# Altium schematic sheet SDRAM.SchDoc: SDRAM
size 420 x 297 mm; CompanyName: STMicroelectronics; Organization: Microcontrollers Division; DocumentNumber: 14; SheetNumber: 9; SheetTotal: 19
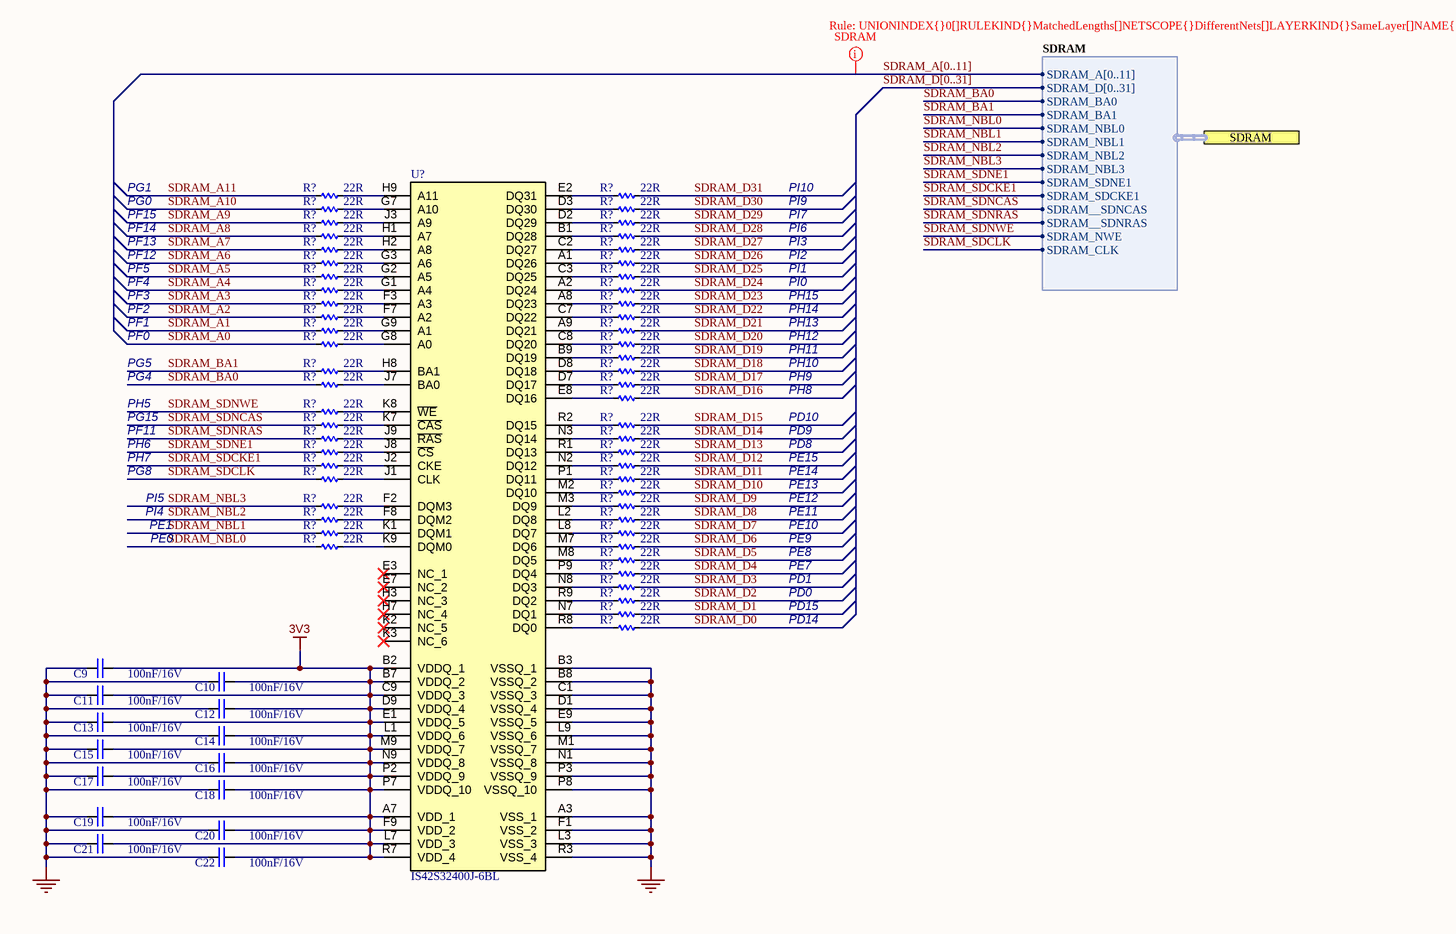
[diagram p0: SDRAM.SchDoc]

## Parts
(Parts that share a designator on the sheet are numbered #1, #2 ... from top to bottom, then left to right.)
C9  100nF/16V  [CAP_C_1608X80]
C10  100nF/16V  [CAP_C_1608X80]
C11  100nF/16V  [CAP_C_1608X80]
C12  100nF/16V  [CAP_C_1608X80]
C13  100nF/16V  [CAP_C_1608X80]
C14  100nF/16V  [CAP_C_1608X80]
C15  100nF/16V  [CAP_C_1608X80]
C16  100nF/16V  [CAP_C_1608X80]
C17  100nF/16V  [CAP_C_1608X80]
C18  100nF/16V  [CAP_C_1608X80]
C19  100nF/16V  [CAP_C_1608X80]
C20  100nF/16V  [CAP_C_1608X80]
C21  100nF/16V  [CAP_C_1608X80]
C22  100nF/16V  [CAP_C_1608X80]
R?#1  22R  [RES_C_1608X60]
R?#2  22R  [RES_C_1608X60]
R?#3  22R  [RES_C_1608X60]
R?#4  22R  [RES_C_1608X60]
R?#5  22R  [RES_C_1608X60]
R?#6  22R  [RES_C_1608X60]
R?#7  22R  [RES_C_1608X60]
R?#8  22R  [RES_C_1608X60]
R?#9  22R  [RES_C_1608X60]
R?#10  22R  [RES_C_1608X60]
R?#11  22R  [RES_C_1608X60]
R?#12  22R  [RES_C_1608X60]
R?#13  22R  [RES_C_1608X60]
R?#14  22R  [RES_C_1608X60]
R?#15  22R  [RES_C_1608X60]
R?#16  22R  [RES_C_1608X60]
R?#17  22R  [RES_C_1608X60]
R?#18  22R  [RES_C_1608X60]
R?#19  22R  [RES_C_1608X60]
R?#20  22R  [RES_C_1608X60]
R?#21  22R  [RES_C_1608X60]
R?#22  22R  [RES_C_1608X60]
R?#23  22R  [RES_C_1608X60]
R?#24  22R  [RES_C_1608X60]
R?#25  22R  [RES_C_1608X60]
R?#26  22R  [RES_C_1608X60]
R?#27  22R  [RES_C_1608X60]
R?#28  22R  [RES_C_1608X60]
R?#29  22R  [RES_C_1608X60]
R?#30  22R  [RES_C_1608X60]
R?#31  22R  [RES_C_1608X60]
R?#32  22R  [RES_C_1608X60]
R?#33  22R  [RES_C_1608X60]
R?#34  22R  [RES_C_1608X60]
R?#35  22R  [RES_C_1608X60]
R?#36  22R  [RES_C_1608X60]
R?#37  22R  [RES_C_1608X60]
R?#38  22R  [RES_C_1608X60]
R?#39  22R  [RES_C_1608X60]
R?#40  22R  [RES_C_1608X60]
R?#41  22R  [RES_C_1608X60]
R?#42  22R  [RES_C_1608X60]
R?#43  22R  [RES_C_1608X60]
R?#44  22R  [RES_C_1608X60]
R?#45  22R  [RES_C_1608X60]
R?#46  22R  [RES_C_1608X60]
R?#47  22R  [RES_C_1608X60]
R?#48  22R  [RES_C_1608X60]
R?#49  22R  [RES_C_1608X60]
R?#50  22R  [RES_C_1608X60]
R?#51  22R  [RES_C_1608X60]
R?#52  22R  [RES_C_1608X60]
R?#53  22R  [RES_C_1608X60]
R?#54  22R  [RES_C_1608X60]
R?#55  22R  [RES_C_1608X60]
R?#56  22R  [RES_C_1608X60]
U?  IS42S32400J-6BL  [BGA90C80P9X15_800X1300X120]

## Ports
SDRAM (harness SDRAM)

## Harnesses
SDRAM: SDRAM_A[0..11], SDRAM__SDNCAS, SDRAM_NBL0, SDRAM_SDNE1, SDRAM_SDCKE1, SDRAM_D[0..31], SDRAM_NBL1, SDRAM_BA0, SDRAM_BA1, SDRAM_NWE, SDRAM_CLK, SDRAM__SDNRAS, SDRAM_NBL3, SDRAM_NBL2

## Nets
3V3: C9.2 C10.2 C11.2 C12.2 C13.2 C14.2 C15.2 C16.2 C17.2 C18.2 C19.2 C20.2 C21.2 C22.2 U?.A7(VDD_1) U?.B2(VDDQ_1) U?.B7(VDDQ_2) U?.C9(VDDQ_3) U?.D9(VDDQ_4) U?.E1(VDDQ_5) U?.F9(VDD_2) U?.L1(VDDQ_6) U?.L7(VDD_3) U?.M9(VDDQ_7) U?.N9(VDDQ_8) U?.P2(VDDQ_9) U?.P7(VDDQ_10) U?.R7(VDD_4)
GND: C9.1 C10.1 C11.1 C12.1 C13.1 C14.1 C15.1 C16.1 C17.1 C18.1 C19.1 C20.1 C21.1 C22.1 U?.A3(VSS_1) U?.B3(VSSQ_1) U?.B8(VSSQ_2) U?.C1(VSSQ_3) U?.D1(VSSQ_4) U?.E9(VSSQ_5) U?.F1(VSS_2) U?.L3(VSS_3) U?.L9(VSSQ_6) U?.M1(VSSQ_7) U?.N1(VSSQ_8) U?.P3(VSSQ_9) U?.P8(VSSQ_10) U?.R3(VSS_4)
SDRAM_A0: R?#23.1
SDRAM_A1: R?#21.1
SDRAM_A2: R?#19.1
SDRAM_A3: R?#17.1
SDRAM_A4: R?#15.1
SDRAM_A5: R?#13.1
SDRAM_A6: R?#11.1
SDRAM_A7: R?#9.1
SDRAM_A8: R?#7.1
SDRAM_A9: R?#5.1
SDRAM_A10: R?#3.1
SDRAM_A11: R?#1.1
SDRAM_BA0: R?#28.1 ; port SDRAM.SDRAM_BA0
SDRAM_BA1: R?#26.1 ; port SDRAM.SDRAM_BA1
SDRAM_D0: R?#56.2
SDRAM_D1: R?#55.2
SDRAM_D2: R?#54.2
SDRAM_D3: R?#53.2
SDRAM_D4: R?#52.2
SDRAM_D5: R?#51.2
SDRAM_D6: R?#50.2
SDRAM_D7: R?#48.2
SDRAM_D8: R?#46.2
SDRAM_D9: R?#44.2
SDRAM_D10: R?#42.2
SDRAM_D11: R?#41.2
SDRAM_D12: R?#39.2
SDRAM_D13: R?#37.2
SDRAM_D14: R?#35.2
SDRAM_D15: R?#33.2
SDRAM_D16: R?#30.2
SDRAM_D17: R?#29.2
SDRAM_D18: R?#27.2
SDRAM_D19: R?#25.2
SDRAM_D20: R?#24.2
SDRAM_D21: R?#22.2
SDRAM_D22: R?#20.2
SDRAM_D23: R?#18.2
SDRAM_D24: R?#16.2
SDRAM_D25: R?#14.2
SDRAM_D26: R?#12.2
SDRAM_D27: R?#10.2
SDRAM_D28: R?#8.2
SDRAM_D29: R?#6.2
SDRAM_D30: R?#4.2
SDRAM_D31: R?#2.2
SDRAM_NBL0: R?#49.1 ; port SDRAM.SDRAM_NBL0
SDRAM_NBL1: R?#47.1 ; port SDRAM.SDRAM_NBL1
SDRAM_NBL2: R?#45.1 ; port SDRAM.SDRAM_NBL2
SDRAM_NBL3: R?#43.1 ; port SDRAM.SDRAM_NBL3
SDRAM_SDCKE1: R?#38.1 ; port SDRAM.SDRAM_SDCKE1
SDRAM_SDCLK: R?#40.1 ; port SDRAM.SDRAM_CLK
SDRAM_SDNCAS: R?#32.1 ; port SDRAM.SDRAM__SDNCAS
SDRAM_SDNE1: R?#36.1 ; port SDRAM.SDRAM_SDNE1
SDRAM_SDNRAS: R?#34.1 ; port SDRAM.SDRAM__SDNRAS
SDRAM_SDNWE: R?#31.1 ; port SDRAM.SDRAM_NWE
NetR?#1_2: R?#1.2 U?.H9(A11)
NetR?#2_1: R?#2.1 U?.E2(DQ31)
NetR?#3_2: R?#3.2 U?.G7(A10)
NetR?#4_1: R?#4.1 U?.D3(DQ30)
NetR?#5_2: R?#5.2 U?.J3(A9)
NetR?#6_1: R?#6.1 U?.D2(DQ29)
NetR?#7_2: R?#7.2 U?.H1(A7)
NetR?#8_1: R?#8.1 U?.B1(DQ28)
NetR?#9_2: R?#9.2 U?.H2(A8)
NetR?#10_1: R?#10.1 U?.C2(DQ27)
NetR?#11_2: R?#11.2 U?.G3(A6)
NetR?#12_1: R?#12.1 U?.A1(DQ26)
NetR?#13_2: R?#13.2 U?.G2(A5)
NetR?#14_1: R?#14.1 U?.C3(DQ25)
NetR?#15_2: R?#15.2 U?.G1(A4)
NetR?#16_1: R?#16.1 U?.A2(DQ24)
NetR?#17_2: R?#17.2 U?.F3(A3)
NetR?#18_1: R?#18.1 U?.A8(DQ23)
NetR?#19_2: R?#19.2 U?.F7(A2)
NetR?#20_1: R?#20.1 U?.C7(DQ22)
NetR?#21_2: R?#21.2 U?.G9(A1)
NetR?#22_1: R?#22.1 U?.A9(DQ21)
NetR?#23_2: R?#23.2 U?.G8(A0)
NetR?#24_1: R?#24.1 U?.C8(DQ20)
NetR?#25_1: R?#25.1 U?.B9(DQ19)
NetR?#26_2: R?#26.2 U?.H8(BA1)
NetR?#27_1: R?#27.1 U?.D8(DQ18)
NetR?#28_2: R?#28.2 U?.J7(BA0)
NetR?#29_1: R?#29.1 U?.D7(DQ17)
NetR?#30_1: R?#30.1 U?.E8(DQ16)
NetR?#31_2: R?#31.2 U?.K8(~{WE})
NetR?#32_2: R?#32.2 U?.K7(~{CAS})
NetR?#33_1: R?#33.1 U?.R2(DQ15)
NetR?#34_2: R?#34.2 U?.J9(~{RAS})
NetR?#35_1: R?#35.1 U?.N3(DQ14)
NetR?#36_2: R?#36.2 U?.J8(~{CS})
NetR?#37_1: R?#37.1 U?.R1(DQ13)
NetR?#38_2: R?#38.2 U?.J2(CKE)
NetR?#39_1: R?#39.1 U?.N2(DQ12)
NetR?#40_2: R?#40.2 U?.J1(CLK)
NetR?#41_1: R?#41.1 U?.P1(DQ11)
NetR?#42_1: R?#42.1 U?.M2(DQ10)
NetR?#43_2: R?#43.2 U?.F2(DQM3)
NetR?#44_1: R?#44.1 U?.M3(DQ9)
NetR?#45_2: R?#45.2 U?.F8(DQM2)
NetR?#46_1: R?#46.1 U?.L2(DQ8)
NetR?#47_2: R?#47.2 U?.K1(DQM1)
NetR?#48_1: R?#48.1 U?.L8(DQ7)
NetR?#49_2: R?#49.2 U?.K9(DQM0)
NetR?#50_1: R?#50.1 U?.M7(DQ6)
NetR?#51_1: R?#51.1 U?.M8(DQ5)
NetR?#52_1: R?#52.1 U?.P9(DQ4)
NetR?#53_1: R?#53.1 U?.N8(DQ3)
NetR?#54_1: R?#54.1 U?.R9(DQ2)
NetR?#55_1: R?#55.1 U?.N7(DQ1)
NetR?#56_1: R?#56.1 U?.R8(DQ0)

Not connected (* = marked no-connect by the designer): U? E3(NC_1)* E7(NC_2)* H3(NC_3)* H7(NC_4)* K2(NC_5)* K3(NC_6)*

## Buses and harness runs
bus SDRAM_A[0..11]
bus SDRAM_D[0..31]

## Layout directives
rule Matched Net Lengths [Tolerance = 100mil]: (no net found under the mark)

## Notes on the sheet
- PF14
- PF15
- PG0
- PG1
- PI10
- PI9
- PI7
- PI6
- PF3
- PF4
- PF5
- PF12
- PF13
- PI3
- PI2
- PI1
- PI0
- PH15
- PF0
- PF1
- PF2
- PG5
- PH14
- PH13
- PH12
- PH11
- PH10
- PH5
- PF11
- PG4
- PG15
- PD9
- PD10
- PH9
- PH8
- PH6
- PH7
- PG8
- PI5
- PE12
- PE13
- PE14
- PE15
- PD8
- PI4
- PE1
- PE0
- PE7
- PE8
- PE9
- PE10
- PE11
- PD14
- PD15
- PD0
- PD1
- Sub-system:
- Design by:
- Sheet title:
- Project:
- Sheet:
- of
- Checked by:
- Approved by:
- Doc no:
- Revision:
- Size:
- Date:

## Library data of the parts
C9-C22 = CAP_SMD: CAP_Chip; Value: 33pF
R?#1-R?#56 = _RES_B_2: RES
U? = IS42S32400J-6BL: DRAM 128M, 3.3V, SDRAM, 4Mx32, 166Mhz, 90 ball BGA (8mmx13mm) RoHS; Manufacturer_Name: Integrated Silicon Solution Inc.; Geometry.Height: 1.2mm; Manufacturer_Part_Number: IS42S32400J-6BL; Mouser Part Number: *; Mouser Price/Stock: *; Arrow Part Number: IS42S32400J-6BL; Arrow Price/Stock: https://www.arrow.com/en/products/is42s32400j-6bl/integrated-silicon-solution-inc?utm_currency=USD&region=nac; Datasheet Link: https://www.issi.com/WW/pdf/42-45S32400J.pdf